# EAGLE schematic ESP8266 (EAGLE 8.4.1)

## Sheet 1 of 2

## Sheet 2 of 2
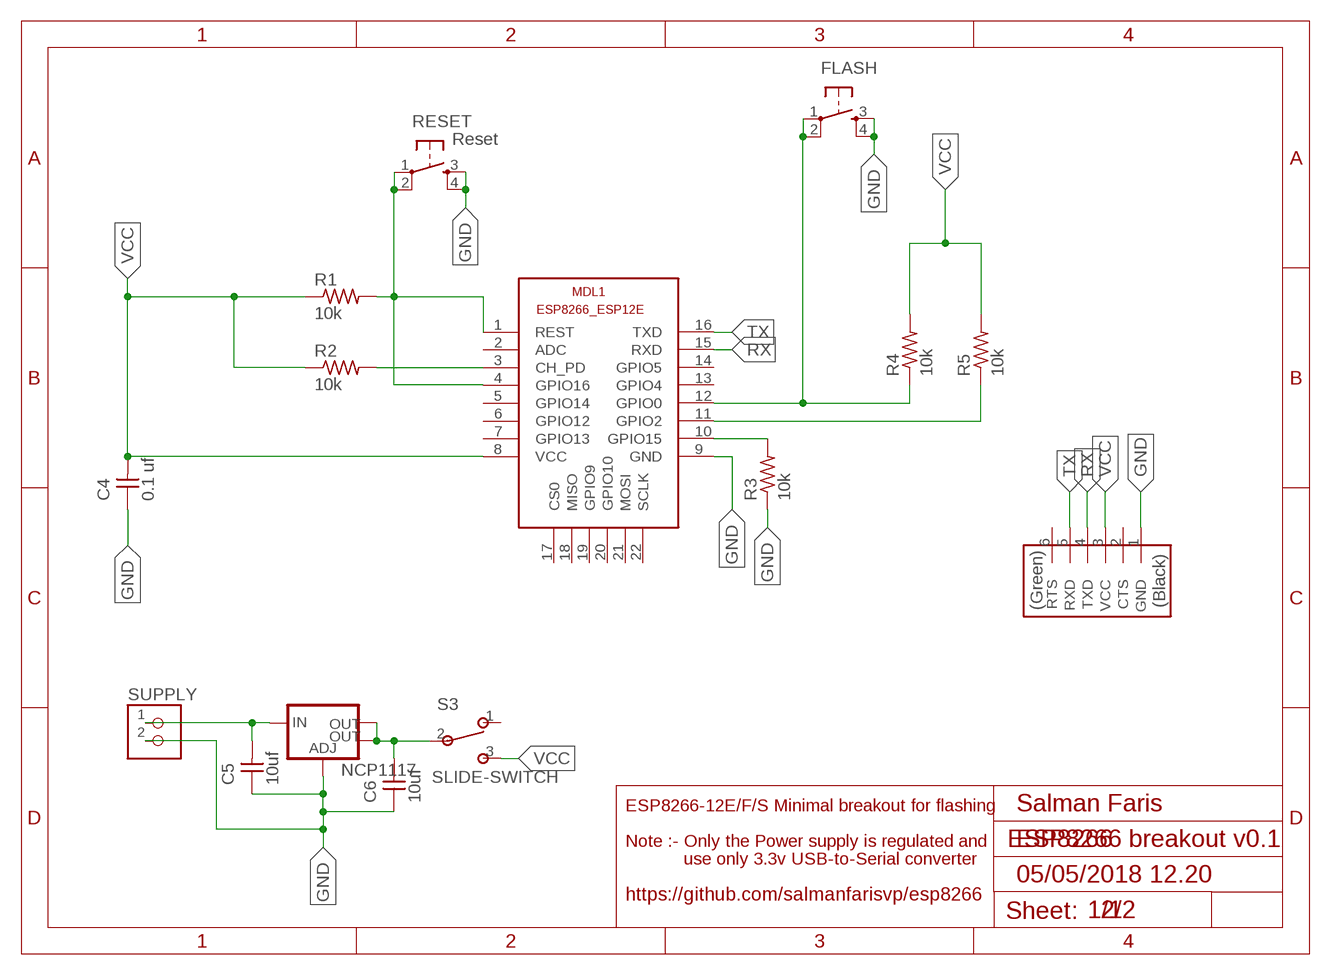
[diagram p0: schematic, sheet 2]

### Parts
C4  0.1 uf  CAP-UNPOLARIZEDFAB  [C1206FAB]
C5  10uf  CAP-UNPOLARIZEDFAB  [C1206FAB]
C6  10uf  CAP-UNPOLARIZEDFAB  [C1206FAB]
FLASH  6MM_SWITCH6MM_SWITCH  [6MM_SWITCH]
FTDI  FTDI-SMD-HEADER  [1X06SMD]
MDL1  ESP8266-12EESP8266-ESP12E  [ESP8266-ESP12E]
NCP1117  V_REG_LM1117SOT223  [SOT223]
R1  10k  RES-US1206FAB  [R1206FAB]
R2  10k  RES-US1206FAB  [R1206FAB]
R3  10k  RES-US1206FAB  [R1206FAB]
R4  10k  RES-US1206FAB  [R1206FAB]
R5  10k  RES-US1206FAB  [R1206FAB]
RESET  Reset  6MM_SWITCH6MM_SWITCH  [6MM_SWITCH]
S3  SLIDE-SWITCH  [AYZ0102AGRLC]
SUPPLY  TERM-1X02-FABLAB  [ED555DS-2DS]

### Nets
GND: C4.1 C5.1 C6.1 FLASH.3(S) FLASH.4(S1) FTDI.1(GND) MDL1.9(GND) NCP1117.1(ADJ) R3.1 RESET.3(S) RESET.4(S1) SUPPLY.2
N$1: C6.2 NCP1117.2(OUT) NCP1117.4(OUT) S3.2
N$2: FLASH.1(P) FLASH.2(P1) MDL1.12(GPIO0) R4.1
N$3: C5.2 NCP1117.3(IN) SUPPLY.1
N$4: MDL1.11(GPIO2) R5.1
N$5: MDL1.1(REST) MDL1.4(GPIO16) R1.2 RESET.1(P) RESET.2(P1)
N$6: MDL1.3(CH_PD) R2.2
N$7: MDL1.10(GPIO15) R3.2
RX: FTDI.4(TXD) MDL1.15(RXD)
TX: FTDI.5(RXD) MDL1.16(TXD)
VCC: C4.2 FTDI.3(VCC) MDL1.8(VCC) R1.1 R2.1 R4.2 R5.2 S3.3
Unconnected: FTDI.2(CTS) FTDI.6(RTS) MDL1.2(ADC) MDL1.5(GPIO14) MDL1.6(GPIO12) MDL1.7(GPIO13) MDL1.13(GPIO4) MDL1.14(GPIO5) MDL1.17(CS0) MDL1.18(MISO) MDL1.19(GPIO9) MDL1.20(GPIO10) MDL1.21(MOSI) MDL1.22(SCLK) S3.1

### Notes on the sheet
- ESP8266-12E/F/S Minimal breakout for flashing | Salman Faris
- Note :- Only the Power supply is regulated and | ESP8266 breakout v0.1
- use only 3.3v USB-to-Serial converter
- 05/05/2018 12.20
- https://github.com/salmanfarisvp/esp8266
- 1/1

## Library data of the parts
C4-C6 = fab:CAP-UNPOLARIZED
FLASH RESET = fab:6MM_SWITCH: OMRON SWITCH
FTDI = fab:FTDI-SMD-HEADER
MDL1 = esp826612E:ESP8266-12E: ESP8266-12E with additional I/O and GPIO04/05 corrected The author cannot warrant that this library is free from error or will meet your specific requirements. Created by PuceBaboon.com. Komagane, Nagano, JAPAN
NCP1117 = fab:V_REG_LM1117: Voltage Regulator LM1117 Standard adjustable voltage regulator but in SMD form. Spark Fun Electronics SKU : COM-00595; PROD_ID: VREG-08170
R1-R5 = fab:RES-US: Resistor (US Symbol) Variants with postfix FAB are widened to allow the routing of internal traces
S3 = fab:SLIDE-SWITCH: SMD slide-switch AYZ0102AGRLC as found in the fablab inventory. Includes the mounting holes. Made by Zaerc.
SUPPLY = fab:TERM-1X02: 3.5mm terminal block, 2 positions ED555-2DS as found in the fablab inventory. Stolen from Adafruit <http://www.ladyada.net/library/pcb/eaglelibrary.html>, adapted by Zaerc.